# Altium project 单片机应用电路.PrjPcb
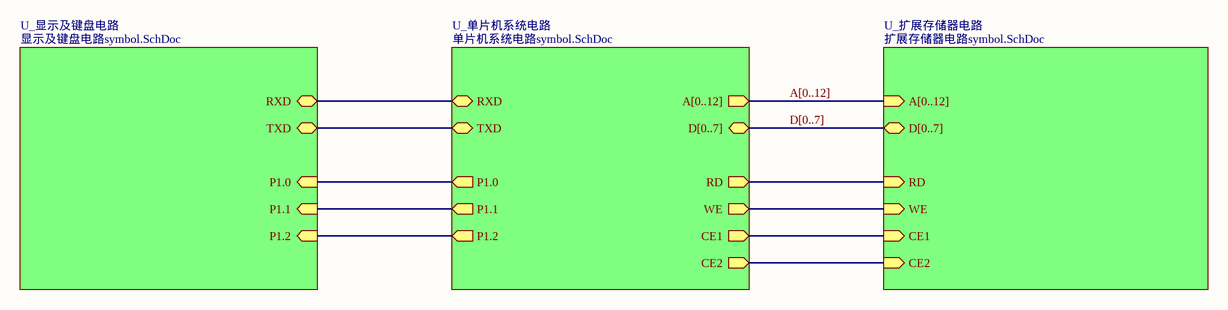
[diagram p0: 单片机系统电路.SchDoc]
4 sheets, 33 parts. Net scope: hierarchical (ports join the sheet entries above them; power ports are global).
Sheets:
  单片机系统电路.SchDoc
    U_单片机系统电路 = 单片机系统电路symbol.SchDoc
    U_显示及键盘电路 = 显示及键盘电路symbol.SchDoc
    U_扩展存储器电路 = 扩展存储器电路symbol.SchDoc

## Sheet 单片机系统电路.SchDoc
size A4; Time: 22/03/31

### Sub-sheets
U_单片机系统电路 = 单片机系统电路symbol.SchDoc: RXD (bidir), TXD (bidir), P1.0 (out), P1.1 (out), P1.2 (out), A[0..12] (out), D[0..7] (bidir), RD (out), WE (out), CE1 (out), CE2 (out)
U_扩展存储器电路 = 扩展存储器电路symbol.SchDoc: A[0..12] (in), D[0..7] (bidir), RD (in), WE (in), CE1 (in), CE2 (in)
U_显示及键盘电路 = 显示及键盘电路symbol.SchDoc: RXD (bidir), TXD (bidir), P1.0 (in), P1.1 (in), P1.2 (in)

### Nets
NetS1_2: sheet U_单片机系统电路/P1.0, sheet U_显示及键盘电路/P1.0
NetS9_2: sheet U_单片机系统电路/P1.1, sheet U_显示及键盘电路/P1.1
NetU1_3: sheet U_单片机系统电路/P1.2, sheet U_显示及键盘电路/P1.2
NetU1_10: sheet U_单片机系统电路/RXD, sheet U_显示及键盘电路/RXD
NetU1_11: sheet U_单片机系统电路/TXD, sheet U_显示及键盘电路/TXD
NetU1_16: sheet U_单片机系统电路/WE, sheet U_扩展存储器电路/WE
NetU1_17: sheet U_单片机系统电路/RD, sheet U_扩展存储器电路/RD
NetU1_27: sheet U_单片机系统电路/CE1, sheet U_扩展存储器电路/CE1
NetU1_28: sheet U_单片机系统电路/CE2, sheet U_扩展存储器电路/CE2

### Buses and harness runs
bus A[0..12] = sheet U_单片机系统电路/A[0..12] = sheet U_扩展存储器电路/A[0..12]
bus D[0..7] = sheet U_单片机系统电路/D[0..7] = sheet U_扩展存储器电路/D[0..7]

### Notes on the sheet
- 专升本
- 通信工程
- 李烨攀
- 2101班
- 210806300163
- 学号

## Sheet 单片机系统电路symbol.SchDoc
size A4
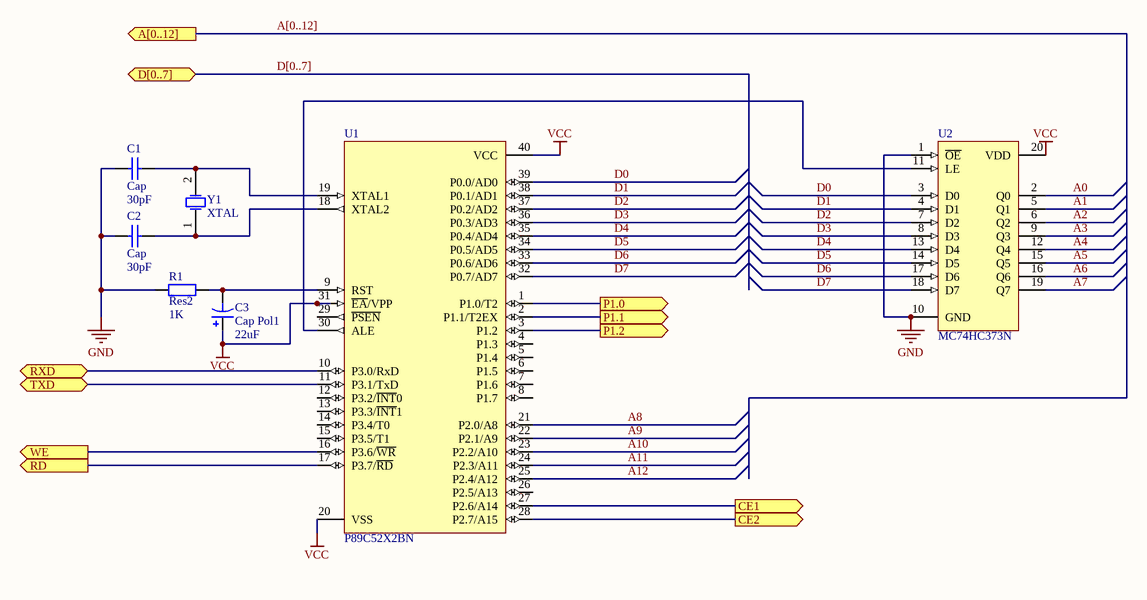
[diagram p1: 单片机系统电路symbol.SchDoc]

### Parts
C1  Cap  value 30pF  [RAD-0.3]
C2  Cap  value 30pF  [RAD-0.3]
C3  Cap Pol1  value 22uF  [RB7.6-15]
R1  Res2  value 1K  [AXIAL-0.4]
U1  P89C52X2BN  [SOT129-1]
U2  MC74HC373N  [738-03]
Y1  XTAL  [R38]

### Ports
A[0..12] (out), CE1 (out), CE2 (out), D[0..7] (bidir), P1.0 (out), P1.1 (out), P1.2 (out), RD (out), RXD (bidir), TXD (bidir), WE (out)

### Nets
GND: C1.1 C2.1 R1.1 U2.1(~{OE}) U2.10(GND)
VCC: C3.1 U1.20(VSS) U1.31(~{EA}/VPP) U1.40(VCC) U2.20(VDD)
A0: U2.2(Q0)
A1: U2.5(Q1)
A2: U2.6(Q2)
A3: U2.9(Q3)
A4: U2.12(Q4)
A5: U2.15(Q5)
A6: U2.16(Q6)
A7: U2.19(Q7)
A8: U1.21(P2.0/A8)
A9: U1.22(P2.1/A9)
A10: U1.23(P2.2/A10)
A11: U1.24(P2.3/A11)
A12: U1.25(P2.4/A12)
D0: U1.39(P0.0/AD0) U2.3(D0)
D1: U1.38(P0.1/AD1) U2.4(D1)
D2: U1.37(P0.2/AD2) U2.7(D2)
D3: U1.36(P0.3/AD3) U2.8(D3)
D4: U1.35(P0.4/AD4) U2.13(D4)
D5: U1.34(P0.5/AD5) U2.14(D5)
D6: U1.33(P0.6/AD6) U2.17(D6)
D7: U1.32(P0.7/AD7) U2.18(D7)
NetC1_2: C1.2 U1.19(XTAL1) Y1.2(OSC2)
NetC2_2: C2.2 U1.18(XTAL2) Y1.1(OSC1)
NetC3_2: C3.2 R1.2 U1.9(RST)
NetS1_2: U1.1(P1.0/T2) ; port P1.0
NetS9_2: U1.2(P1.1/T2EX) ; port P1.1
NetU1_3: U1.3(P1.2) ; port P1.2
NetU1_10: U1.10(P3.0/RxD) ; port RXD
NetU1_11: U1.11(P3.1/TxD) ; port TXD
NetU1_16: U1.16(P3.6/~{WR}) ; port WE
NetU1_17: U1.17(P3.7/~{RD}) ; port RD
NetU1_27: U1.27(P2.6/A14) ; port CE1
NetU1_28: U1.28(P2.7/A15) ; port CE2
NetU1_30: U1.30(ALE) U2.11(LE)

Not connected (* = marked no-connect by the designer): U1 4(P1.3) 5(P1.4) 6(P1.5) 7(P1.6) 8(P1.7) 12(P3.2/~{INT}0) 13(P3.3/~{INT}1) 14(P3.4/T0) 15(P3.5/T1) 26(P2.5/A13) 29(~{PSEN})

### Buses and harness runs
bus A[0..12] = port A[0..12]
bus D[0..7] = port D[0..7]

### Notes on the sheet
- 专升本
- 通信工程
- 李烨攀
- 2101班
- 210806300163
- 学号

### Library data of the parts
C1 C2 = Cap: Capacitor; Published: 8-Jun-2000; LatestRevisionDate: 17-Jul-2002; LatestRevisionNote: Re-released for DXP Platform.; PackageReference: RAD-0.3; Publisher: Altium Limited; PackageDescription: Radial Cap, Thru-Hole; 2 Leads; 0.3 in Pin Spacing
C3 = Cap Pol1: Polarized Capacitor (Radial); Published: 8-Jun-2000; LatestRevisionDate: 17-Jul-2002; LatestRevisionNote: Re-released for DXP Platform.; PackageReference: RB7.6-15; Publisher: Altium Limited; PackageDescription: Polarized Capacitor (Radial); 2 Leads
R1 = Res2: Resistor; Published: 8-Jun-2000; LatestRevisionDate: 17-Jul-2002; LatestRevisionNote: Re-released for DXP Platform.; PackageReference: AXIAL-0.4; Publisher: Altium Limited; PackageDescription: Axial Device, Thru-Hole; 2 Leads; 0.4 in Pin Spacing
U1 = P89C52X2BN: 80C51 8-Bit Flash Microcontroller Family, 8 kB Flash; Published: 21-May-2003; DatasheetVersion: 5-Jun-2002; PackageVersion: Aug-2000; PackageReference: SOT129-1; Publisher: Altium Limited; PackageDescription: DIP, Plastic; 40 Leads; Row Spacing 15.24 mm; Pitch 2.54 mm; Code_JEDEC: MO-015; ComponentLink1Description: Manufacturer Link; ComponentLink1URL: http://www-us2.semiconductors.philips.com/; ComponentLink2Description: Datasheet; ComponentLink2URL: http://www.semiconductors.philips.com/acrobat/datasheets/P89C5XX2_2.pdf
U2 = MC74HC373N: Octal 3-State Non-Inverting Transparent Latch; Published: 17-Jul-2002; LatestRevisionDate: 06-Jun-2005; LatestRevisionNote: Stylized 3D Model Added; DatasheetVersion: 1989; PackageReference: 738-03; Publisher: Altium Limited; PackageDescription: DIP; 20 Leads; Row Spacing 7.62 mm; Pitch 2.54 mm; Code_JEDEC: MS-001-AD; ComponentLink1Description: Manufacturer Link; ComponentLink1URL: http://www.onsemi.com/site/products/parametrics/0,4446,339,00.html
Y1 = XTAL: Crystal Oscillator; Published: 8-Jun-2000; LatestRevisionDate: 17-Jul-2002; LatestRevisionNote: Re-released for DXP Platform.; PackageReference: R38; Publisher: Altium Limited; PackageDescription: Crystal, Thru-Hole; 2 Leads; Body 3.1 x 8.2 mm (Dia.xH)

## Sheet 显示及键盘电路symbol.SchDoc
size A4
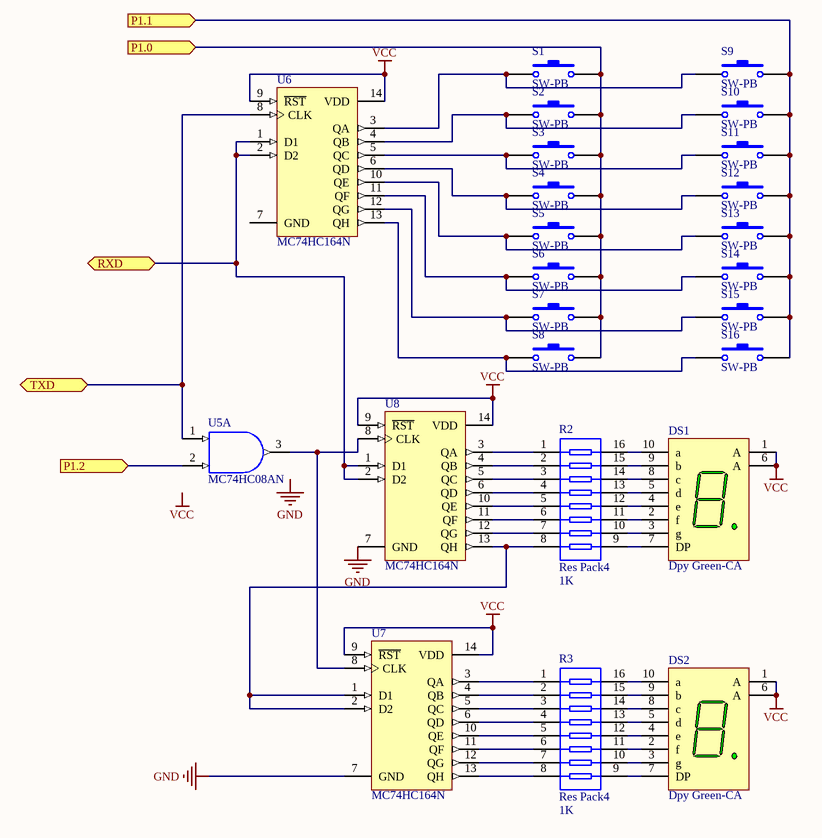
[diagram p2: 显示及键盘电路symbol.SchDoc]

### Parts
DS1  Dpy Green-CA  [A]
DS2  Dpy Green-CA  [A]
R2  Res Pack4  value 1K  [SSOP16_N]
R3  Res Pack4  value 1K  [SSOP16_N]
S1  SW-PB  [SPST-2]
S2  SW-PB  [SPST-2]
S3  SW-PB  [SPST-2]
S4  SW-PB  [SPST-2]
S5  SW-PB  [SPST-2]
S6  SW-PB  [SPST-2]
S7  SW-PB  [SPST-2]
S8  SW-PB  [SPST-2]
S9  SW-PB  [SPST-2]
S10  SW-PB  [SPST-2]
S11  SW-PB  [SPST-2]
S12  SW-PB  [SPST-2]
S13  SW-PB  [SPST-2]
S14  SW-PB  [SPST-2]
S15  SW-PB  [SPST-2]
S16  SW-PB  [SPST-2]
U5  MC74HC08AN  [646-06]  (part A of 4)
U6  MC74HC164N  [646-06]
U7  MC74HC164N  [646-06]
U8  MC74HC164N  [646-06]

### Ports
P1.0 (in), P1.1 (in), P1.2 (in), RXD (bidir), TXD (bidir)

### Nets
GND: U5.7(GND) U7.7(GND) U8.7(GND)
VCC: DS1.1(A) DS1.6(A) DS2.1(A) DS2.6(A) U5.14(VDD) U6.9(~{RST}) U6.14(VDD) U7.9(~{RST}) U7.14(VDD) U8.9(~{RST}) U8.14(VDD)
NetDS1_2: DS1.2(f) R2.11
NetDS1_3: DS1.3(g) R2.10
NetDS1_4: DS1.4(e) R2.12
NetDS1_5: DS1.5(d) R2.13
NetDS1_7: DS1.7(DP) R2.9
NetDS1_8: DS1.8(c) R2.14
NetDS1_9: DS1.9(b) R2.15
NetDS1_10: DS1.10(a) R2.16
NetDS2_2: DS2.2(f) R3.11
NetDS2_3: DS2.3(g) R3.10
NetDS2_4: DS2.4(e) R3.12
NetDS2_5: DS2.5(d) R3.13
NetDS2_7: DS2.7(DP) R3.9
NetDS2_8: DS2.8(c) R3.14
NetDS2_9: DS2.9(b) R3.15
NetDS2_10: DS2.10(a) R3.16
NetR2_1: R2.1 U8.3(QA)
NetR2_2: R2.2 U8.4(QB)
NetR2_3: R2.3 U8.5(QC)
NetR2_4: R2.4 U8.6(QD)
NetR2_5: R2.5 U8.10(QE)
NetR2_6: R2.6 U8.11(QF)
NetR2_7: R2.7 U8.12(QG)
NetR2_8: R2.8 U7.1(D1) U7.2(D2) U8.13(QH)
NetR3_1: R3.1 U7.3(QA)
NetR3_2: R3.2 U7.4(QB)
NetR3_3: R3.3 U7.5(QC)
NetR3_4: R3.4 U7.6(QD)
NetR3_5: R3.5 U7.10(QE)
NetR3_6: R3.6 U7.11(QF)
NetR3_7: R3.7 U7.12(QG)
NetR3_8: R3.8 U7.13(QH)
NetS1_1: S1.1 S9.1 U6.3(QA)
NetS1_2: S1.2 S2.2 S3.2 S4.2 S5.2 S6.2 S7.2 S8.2 ; port P1.0
NetS2_1: S2.1 S10.1 U6.4(QB)
NetS3_1: S3.1 S11.1 U6.5(QC)
NetS4_1: S4.1 S12.1 U6.6(QD)
NetS5_1: S5.1 S13.1 U6.10(QE)
NetS6_1: S6.1 S14.1 U6.11(QF)
NetS7_1: S7.1 S15.1 U6.12(QG)
NetS8_1: S8.1 S16.1 U6.13(QH)
NetS9_2: S9.2 S10.2 S11.2 S12.2 S13.2 S14.2 S15.2 S16.2 ; port P1.1
NetU1_3: U5.2(B) ; port P1.2
NetU1_10: U6.1(D1) U6.2(D2) U8.1(D1) U8.2(D2) ; port RXD
NetU1_11: U5.1(A) U6.8(CLK) ; port TXD
NetU5_3: U5.3(Y) U7.8(CLK) U8.8(CLK)

Not connected (* = marked no-connect by the designer): U6 7(GND)

### Notes on the sheet
- Labels drawn without touching a wire or pin: GND, VCC
- 专升本
- 通信工程
- 李烨攀
- 2101班
- 210806300163
- 学号

### Library data of the parts
DS1 DS2 = Dpy Green-CA: 7.62 mm Black Surface Green 7-Segment Display: CA, RH DP; MinimumIntensity: 860 ucd; Note: IF = 10 mA; Note: Pins 1 and 6 are redundant Anodes.; Published: 8-Jun-2000; LatestRevisionDate: 17-Dec-2003; LatestRevisionNote: Schematic revised, PCB Footprint replaced.; DatasheetVersion: 19-Feb-2002; PackageVersion: 11-Feb-2002; PackageReference: A; Publisher: Altium Limited; PackageDescription: LED, 7-Segment Display, 7.62 mm, RHD; 10 Leads; Row Space 5.08 mm; Pitch 2.54 mm; Colour: Green; ComponentLink1Description: Manufacturer Link; ComponentLink1URL: http://www.agilent.com/
R2 R3 = Res Pack4: Isolated Resistor Network; Published: 24-Mar-1999; LatestRevisionDate: 29-May-2009; LatestRevisionNote: IPC-7351 Footprint Added.; PackageVersion: Oct-2003; PackageReference: SSOP16; Publisher: Altium Limited; PackageDescription: 16-Pin Plastic Small Outline Package 0.65 mm Pitch; Code_JEDEC: MO-150-AC; Code_IPC: SOP65P780-16
S1-S16 = SW-PB: Switch; Published: 24-Mar-1999; LatestRevisionDate: 17-Jul-2002; LatestRevisionNote: Re-released for DXP Platform.; PackageReference: SPST-2; Publisher: Altium Limited; PackageDescription: Switch; 2 Leads
U5 = MC74HC08AN: Quad 2-Input AND Gate; Published: 17-Jul-2002; LatestRevisionDate: 06-Jun-2005; LatestRevisionNote: Stylized 3D Model Added; DatasheetVersion: 1989; PackageVersion: 1997; PackageReference: 646-06; Publisher: Altium Limited; PackageDescription: DIP; 14 Leads; Row Spacing 7.62 mm; Pitch 2.54 mm; ComponentLink1Description: Manufacturer Link; ComponentLink1URL: http://www.onsemi.com/site/products/parametrics/0,4446,247,00.html; ComponentLink2Description: Ibis Model; ComponentLink2URL: http://www.onsemi.com/pub/Collateral/MC54HC08AJ.IBS
U6-U8 = MC74HC164N: 8-Bit Serial-Input/Parallel-Output Shift Register; Published: 17-Jul-2002; LatestRevisionDate: 06-Jun-2005; LatestRevisionNote: Stylized 3D Model Added; DatasheetVersion: 1989; PackageVersion: 1997; PackageReference: 646-06; Publisher: Altium Limited; PackageDescription: DIP; 14 Leads; Row Spacing 7.62 mm; Pitch 2.54 mm; ComponentLink1Description: Manufacturer Link; ComponentLink1URL: http://www.onsemi.com/site/products/parametrics/0,4446,557,00.html

## Sheet 扩展存储器电路symbol.SchDoc
size A4
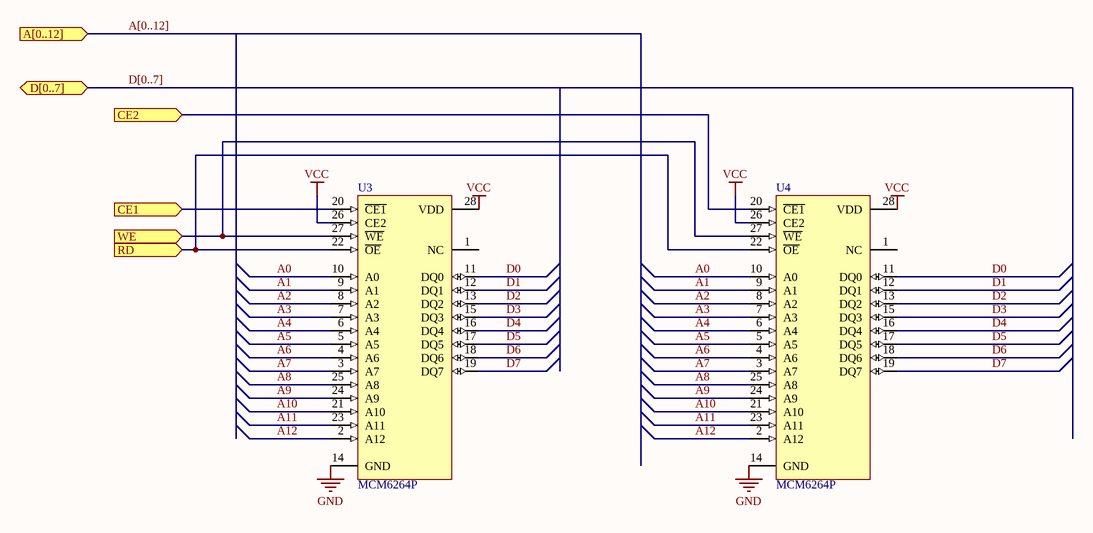
[diagram p3: 扩展存储器电路symbol.SchDoc]

### Parts
U3  MCM6264P  [710B-01]
U4  MCM6264P  [710B-01]

### Ports
A[0..12] (in), CE1 (in), CE2 (in), D[0..7] (bidir), RD (in), WE (in)

### Nets
GND: U3.14(GND) U4.14(GND)
VCC: U3.26(CE2) U3.28(VDD) U4.26(CE2) U4.28(VDD)
A0: U3.10(A0) U4.10(A0)
A1: U3.9(A1) U4.9(A1)
A2: U3.8(A2) U4.8(A2)
A3: U3.7(A3) U4.7(A3)
A4: U3.6(A4) U4.6(A4)
A5: U3.5(A5) U4.5(A5)
A6: U3.4(A6) U4.4(A6)
A7: U3.3(A7) U4.3(A7)
A8: U3.25(A8) U4.25(A8)
A9: U3.24(A9) U4.24(A9)
A10: U3.21(A10) U4.21(A10)
A11: U3.23(A11) U4.23(A11)
A12: U3.2(A12) U4.2(A12)
D0: U3.11(DQ0) U4.11(DQ0)
D1: U3.12(DQ1) U4.12(DQ1)
D2: U3.13(DQ2) U4.13(DQ2)
D3: U3.15(DQ3) U4.15(DQ3)
D4: U3.16(DQ4) U4.16(DQ4)
D5: U3.17(DQ5) U4.17(DQ5)
D6: U3.18(DQ6) U4.18(DQ6)
D7: U3.19(DQ7) U4.19(DQ7)
NetU1_16: U3.27(~{WE}) U4.27(~{WE}) ; port WE
NetU1_17: U3.22(~{OE}) U4.22(~{OE}) ; port RD
NetU1_27: U3.20(~{CE1}) ; port CE1
NetU1_28: U4.20(~{CE1}) ; port CE2

Not connected (* = marked no-connect by the designer): U3 1(NC); U4 1(NC)

### Buses and harness runs
bus A[0..12] = port A[0..12]
bus D[0..7] = port D[0..7]

### Notes on the sheet
- 专升本
- 通信工程
- 李烨攀
- 2101班
- 210806300163
- 学号

### Library data of the parts
U3 U4 = MCM6264P: 8K x 8-Bit Fast Static RAM; Published: 17-Jul-2002; LatestRevisionDate: 06-Jun-2005; LatestRevisionNote: Stylized 3D Model Added.; DatasheetVersion: 1991; PackageReference: 710B-01; Publisher: Altium Limited; PackageDescription: DIP; 28 Leads; Row Spacing 7.62 mm; Pitch 2.54 mm; ComponentLink1Description: Manufacturer Link; ComponentLink1URL: http://www.motorola.com/

## Nets that join several sheets
GND: 单片机系统电路symbol (5 pins), 显示及键盘电路symbol (U5.7 U7.7 U8.7), 扩展存储器电路symbol (U3.14 U4.14)
VCC: 单片机系统电路symbol (5 pins), 显示及键盘电路symbol (11 pins), 扩展存储器电路symbol (U3.26 U3.28 U4.26 U4.28)
A0: 单片机系统电路symbol (U2.2), 扩展存储器电路symbol (U3.10 U4.10)
A1: 单片机系统电路symbol (U2.5), 扩展存储器电路symbol (U3.9 U4.9)
A2: 单片机系统电路symbol (U2.6), 扩展存储器电路symbol (U3.8 U4.8)
A3: 单片机系统电路symbol (U2.9), 扩展存储器电路symbol (U3.7 U4.7)
A4: 单片机系统电路symbol (U2.12), 扩展存储器电路symbol (U3.6 U4.6)
A5: 单片机系统电路symbol (U2.15), 扩展存储器电路symbol (U3.5 U4.5)
A6: 单片机系统电路symbol (U2.16), 扩展存储器电路symbol (U3.4 U4.4)
A7: 单片机系统电路symbol (U2.19), 扩展存储器电路symbol (U3.3 U4.3)
A8: 单片机系统电路symbol (U1.21), 扩展存储器电路symbol (U3.25 U4.25)
A9: 单片机系统电路symbol (U1.22), 扩展存储器电路symbol (U3.24 U4.24)
A10: 单片机系统电路symbol (U1.23), 扩展存储器电路symbol (U3.21 U4.21)
A11: 单片机系统电路symbol (U1.24), 扩展存储器电路symbol (U3.23 U4.23)
A12: 单片机系统电路symbol (U1.25), 扩展存储器电路symbol (U3.2 U4.2)
D0: 单片机系统电路symbol (U1.39 U2.3), 扩展存储器电路symbol (U3.11 U4.11)
D1: 单片机系统电路symbol (U1.38 U2.4), 扩展存储器电路symbol (U3.12 U4.12)
D2: 单片机系统电路symbol (U1.37 U2.7), 扩展存储器电路symbol (U3.13 U4.13)
D3: 单片机系统电路symbol (U1.36 U2.8), 扩展存储器电路symbol (U3.15 U4.15)
D4: 单片机系统电路symbol (U1.35 U2.13), 扩展存储器电路symbol (U3.16 U4.16)
D5: 单片机系统电路symbol (U1.34 U2.14), 扩展存储器电路symbol (U3.17 U4.17)
D6: 单片机系统电路symbol (U1.33 U2.17), 扩展存储器电路symbol (U3.18 U4.18)
D7: 单片机系统电路symbol (U1.32 U2.18), 扩展存储器电路symbol (U3.19 U4.19)
NetS1_2: 单片机系统电路symbol (U1.1), 显示及键盘电路symbol (8 pins)
NetS9_2: 单片机系统电路symbol (U1.2), 显示及键盘电路symbol (8 pins)
NetU1_3: 单片机系统电路symbol (U1.3), 显示及键盘电路symbol (U5.2)
NetU1_10: 单片机系统电路symbol (U1.10), 显示及键盘电路symbol (U6.1 U6.2 U8.1 U8.2)
NetU1_11: 单片机系统电路symbol (U1.11), 显示及键盘电路symbol (U5.1 U6.8)
NetU1_16: 单片机系统电路symbol (U1.16), 扩展存储器电路symbol (U3.27 U4.27)
NetU1_17: 单片机系统电路symbol (U1.17), 扩展存储器电路symbol (U3.22 U4.22)
NetU1_27: 单片机系统电路symbol (U1.27), 扩展存储器电路symbol (U3.20)
NetU1_28: 单片机系统电路symbol (U1.28), 扩展存储器电路symbol (U4.20)